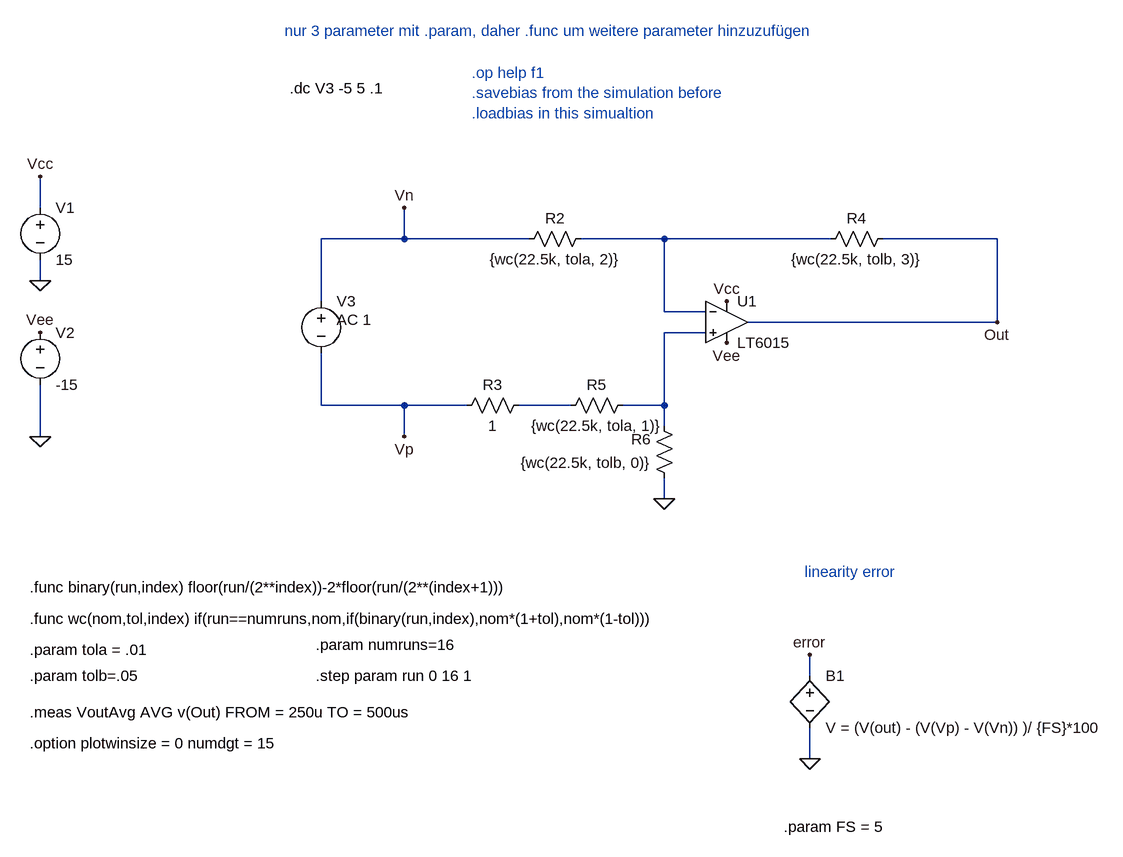
[diagram p0: schematic 11_2_opamp_linerror.asc]
11_2_opamp_linerror.asc, the LTspice schematic file:
Version 4
SHEET 1 1152 680
WIRE -960 -336 -960 -384
WIRE -400 -288 -400 -336
WIRE -400 -288 -528 -288
WIRE -208 -288 -400 -288
WIRE 0 -288 -128 -288
WIRE 256 -288 0 -288
WIRE 512 -288 336 -288
WIRE -960 -224 -960 -256
WIRE -528 -192 -528 -288
WIRE 0 -176 0 -288
WIRE 64 -176 0 -176
WIRE 512 -160 512 -288
WIRE 512 -160 128 -160
WIRE 64 -144 0 -144
WIRE -528 -32 -528 -112
WIRE -400 -32 -528 -32
WIRE -304 -32 -400 -32
WIRE -144 -32 -224 -32
WIRE 0 -32 0 -144
WIRE 0 -32 -64 -32
WIRE 0 0 0 -32
WIRE -960 16 -960 -64
WIRE -400 16 -400 -32
WIRE 0 112 0 80
WIRE 224 384 224 352
WIRE 224 512 224 464
FLAG -960 16 0
FLAG -960 -224 0
FLAG 0 112 0
FLAG 96 -192 Vcc
FLAG 96 -128 Vee
FLAG -960 -144 Vee
FLAG -960 -384 Vcc
FLAG 512 -160 Out
FLAG 224 512 0
FLAG 224 352 error
FLAG -400 -336 Vn
FLAG -400 16 Vp
SYMBOL voltage -960 -352 R0
SYMATTR InstName V1
SYMATTR Value 15
SYMBOL voltage -960 -160 R0
SYMATTR InstName V2
SYMATTR Value -15
SYMBOL res -112 -304 R90
WINDOW 0 0 56 VBottom 2
WINDOW 3 32 56 VTop 2
SYMATTR InstName R2
SYMATTR Value {wc(22.5k, tola, 2)}
SYMBOL res -208 -48 R90
WINDOW 0 0 56 VBottom 2
WINDOW 3 32 56 VTop 2
SYMATTR InstName R3
SYMATTR Value 1
SYMBOL res 352 -304 R90
WINDOW 0 0 56 VBottom 2
WINDOW 3 32 56 VTop 2
SYMATTR InstName R4
SYMATTR Value {wc(22.5k, tolb, 3)}
SYMBOL res -48 -48 R90
WINDOW 0 0 56 VBottom 2
WINDOW 3 32 56 VTop 2
SYMATTR InstName R5
SYMATTR Value {wc(22.5k, tola, 1)}
SYMBOL res 16 96 R180
WINDOW 0 36 76 Left 2
WINDOW 3 36 40 Left 2
SYMATTR InstName R6
SYMATTR Value {wc(22.5k, tolb, 0)}
SYMBOL bv 224 368 R0
SYMATTR InstName B1
SYMATTR Value V = (V(out) - (V(Vp) - V(Vn)) )/ {FS}*100
SYMBOL voltage -528 -208 R0
WINDOW 123 24 44 Left 2
WINDOW 39 0 0 Left 0
SYMATTR InstName V3
SYMATTR Value ""
SYMATTR Value2 AC 1
SYMBOL OpAmps\\LT6015 96 -160 R0
SYMATTR InstName U1
TEXT -584 -608 Left 2 ;nur 3 parameter mit .param, daher .func um weitere parameter hinzuzufügen
TEXT -976 248 Left 2 !.func binary(run,index) floor(run/(2**index))-2*floor(run/(2**(index+1)))
TEXT -976 296 Left 2 !.func wc(nom,tol,index) if(run==numruns,nom,if(binary(run,index),nom*(1+tol),nom*(1-tol)))
TEXT -976 344 Left 2 !.param tola = .01
TEXT -976 384 Left 2 !.param tolb=.05
TEXT -536 336 Left 2 !.param numruns=16
TEXT -536 384 Left 2 !.step param run 0 16 1
TEXT -976 440 Left 2 !.meas VoutAvg AVG v(Out) FROM = 250u TO = 500us
TEXT -976 488 Left 2 !.option plotwinsize = 0 numdgt = 15
TEXT 216 224 Left 2 ;linearity error
TEXT 184 616 Left 2 !.param FS = 5
TEXT -576 -520 Left 2 !.dc V3 -5 5 .1
TEXT -296 -544 Left 2 ;.op help f1\n.savebias from the simulation before\n.loadbias in this simualtion

The netlist it stands for:
* 11_2_opamp_linerror.asc
V1 Vcc 0 15
V2 Vee 0 -15
R2 N001 Vn {wc(22.5k, tola, 2)}
R3 N003 Vp 1
R4 Out N001 {wc(22.5k, tolb, 3)}
R5 N002 N003 {wc(22.5k, tola, 1)}
R6 0 N002 {wc(22.5k, tolb, 0)}
B1 error 0 V = (V(out) - (V(Vp) - V(Vn)) )/ {FS}*100
V3 Vn Vp AC 1
XU1 N002 N001 Vcc Vee Out LT6016  ; LT6015, pins In+ In- V+ V- OUT
* nur 3 parameter mit .param, daher .func um weitere parameter hinzuzufügen
.func binary(run,index) floor(run/(2**index))-2*floor(run/(2**(index+1)))
.func wc(nom,tol,index) if(run==numruns,nom,if(binary(run,index),nom*(1+tol),nom*(1-tol)))
.param tola = .01
.param tolb=.05
.param numruns=16
.step param run 0 16 1
.meas VoutAvg AVG v(Out) FROM = 250u TO = 500us
.option plotwinsize = 0 numdgt = 15
* linearity error
.param FS = 5
.dc V3 -5 5 .1
* .op help f1
* .savebias from the simulation before
* .loadbias in this simualtion
.lib LTC2.lib
.backanno
.end